# Altium schematic sheet Audio-Out.SchDoc
size A3; Date: 27.05.2014; DrawnBy: luths8; Organization: BFH; Address1: Bern University of Applied Sciences; Address2: Engineering and Information Technology; Address3: Jlcoweg 1; Address4: CH-3400 Burgdorf; DocumentNumber: 10; Revision: 1.0; SheetNumber: 3; SheetTotal: 19; CurrentDate: 27.05.2014
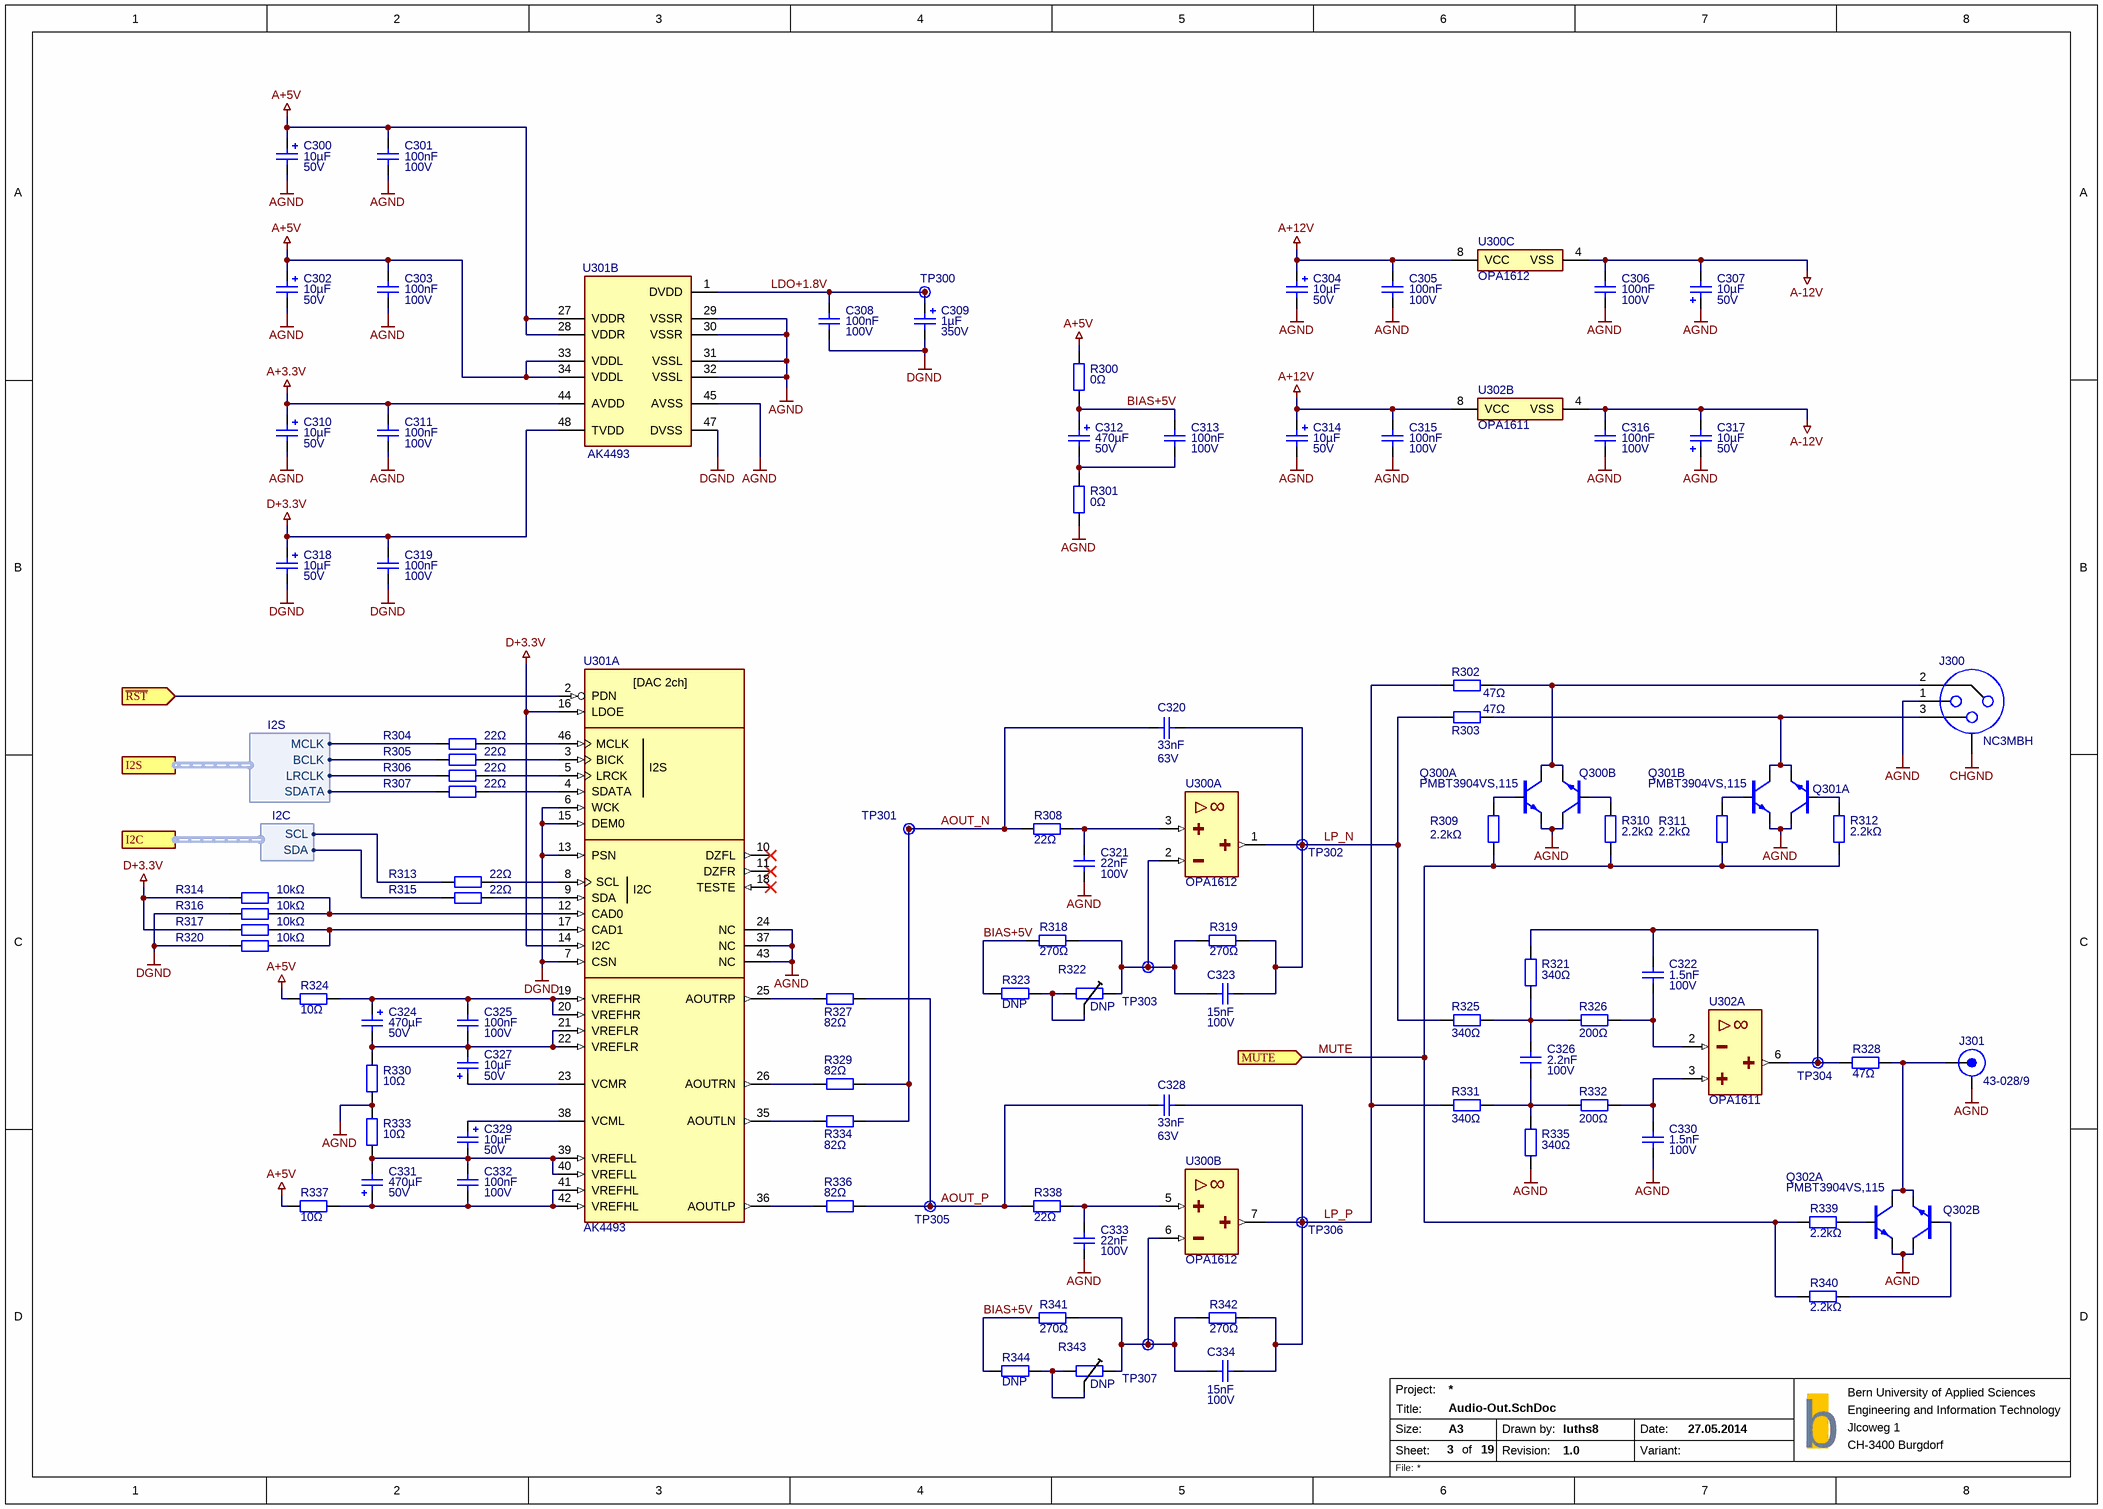
[diagram p0: Audio-Out.SchDoc]

## Parts
C300  10µF  Voltage: 50V  [CAP-5-11.5-2]
C301  100nF  Voltage: 100V  [CAP_WIMA_MKP4F]
C302  10µF  Voltage: 50V  [CAP-5-11.5-2]
C303  100nF  Voltage: 100V  [CAP_WIMA_MKP4F]
C304  10µF  Voltage: 50V  [CAP-5-11.5-2]
C305  100nF  Voltage: 100V  [CAP_WIMA_MKP4F]
C306  100nF  Voltage: 100V  [CAP_WIMA_MKP4F]
C307  10µF  Voltage: 50V  [CAP-5-11.5-2]
C308  100nF  Voltage: 100V  [CAP_WIMA_MKP4F]
C309  1µF  Voltage: 350V  [CAP-6.3-11.2-2.5]
C310  10µF  Voltage: 50V  [CAP-5-11.5-2]
C311  100nF  Voltage: 100V  [CAP_WIMA_MKP4F]
C312  470µF  Voltage: 50V  [CAP-12.5-20-5]
C313  100nF  Voltage: 100V  [CAP_WIMA_MKP4F]
C314  10µF  Voltage: 50V  [CAP-5-11.5-2]
C315  100nF  Voltage: 100V  [CAP_WIMA_MKP4F]
C316  100nF  Voltage: 100V  [CAP_WIMA_MKP4F]
C317  10µF  Voltage: 50V  [CAP-5-11.5-2]
C318  10µF  Voltage: 50V  [CAP-5-11.5-2]
C319  100nF  Voltage: 100V  [CAP_WIMA_MKP4F]
C320  33nF  Voltage: 63V  [CAP_WIMA_FKP2C]
C321  22nF  Voltage: 100V  [CAP_WIMA_FKP2C]
C322  1.5nF  Voltage: 100V  [CAP_WIMA_FKP2D]
C323  15nF  Voltage: 100V  [CAP_WIMA_FKP2C]
C324  470µF  Voltage: 50V  [CAP-12.5-20-5]
C325  100nF  Voltage: 100V  [CAP_WIMA_MKP4F]
C326  2.2nF  Voltage: 100V  [CAP_WIMA_FKP2D]
C327  10µF  Voltage: 50V  [CAP-5-11.5-2]
C328  33nF  Voltage: 63V  [CAP_WIMA_FKP2C]
C329  10µF  Voltage: 50V  [CAP-5-11.5-2]
C330  1.5nF  Voltage: 100V  [CAP_WIMA_FKP2D]
C331  470µF  Voltage: 50V  [CAP-12.5-20-5]
C332  100nF  Voltage: 100V  [CAP_WIMA_MKP4F]
C333  22nF  Voltage: 100V  [CAP_WIMA_FKP2C]
C334  15nF  Voltage: 100V  [CAP_WIMA_FKP2C]
J300  NC3MBH  [NC3MBH]
J301  43-028/9  [RCA-Plug]
Q300  PMBT3904VS,115  [SOT-666]  (parts A,B of 2)
Q301  PMBT3904VS,115  [SOT-666]  (value not drawn)  (parts A,B of 2)
Q302  PMBT3904VS,115  [SOT-666]  (parts A,B of 2)
R300  0Ω  [SMD0603RES]
R301  0Ω  [SMD0603RES]
R302  47Ω  [SMD0603RES]
R303  47Ω  [SMD0603RES]
R304  22Ω  [SMD0603RES]
R305  22Ω  [SMD0603RES]
R306  22Ω  [SMD0603RES]
R307  22Ω  [SMD0603RES]
R308  22Ω  [SMD0603RES]
R309  2.2kΩ  [SMD0603RES]
R310  2.2kΩ  [SMD0603RES]
R311  2.2kΩ  [SMD0603RES]
R312  2.2kΩ  [SMD0603RES]
R313  22Ω  [SMD0603RES]
R314  10kΩ  [SMD0603RES]
R315  22Ω  [SMD0603RES]
R316  10kΩ  [SMD0603RES]
R317  10kΩ  [SMD0603RES]
R318  270Ω  [SMD0603RES]
R319  270Ω  [SMD0603RES]
R320  10kΩ  [SMD0603RES]
R321  340Ω  [SMD0603RES]
R322  DNP  [3266]
R323  DNP  [SMD0603RES]
R324  10Ω  [SMD0603RES]
R325  340Ω  [SMD0603RES]
R326  200Ω  [SMD0603RES]
R327  82Ω  [SMD0603RES]
R328  47Ω  [SMD0603RES]
R329  82Ω  [SMD0603RES]
R330  10Ω  [SMD0603RES]
R331  340Ω  [SMD0603RES]
R332  200Ω  [SMD0603RES]
R333  10Ω  [SMD0603RES]
R334  82Ω  [SMD0603RES]
R335  340Ω  [SMD0603RES]
R336  82Ω  [SMD0603RES]
R337  10Ω  [SMD0603RES]
R338  22Ω  [SMD0603RES]
R339  2.2kΩ  [SMD0603RES]
R340  2.2kΩ  [SMD0603RES]
R341  270Ω  [SMD0603RES]
R342  270Ω  [SMD0603RES]
R343  DNP  [3266]
R344  DNP  [SMD0603RES]
TP300  Testpoint  [TP]  (value not drawn)  (no BOM)
TP301  Testpoint  [TP]  (value not drawn)  (no BOM)
TP302  Testpoint  [TP]  (value not drawn)  (no BOM)
TP303  Testpoint  [TP]  (value not drawn)  (no BOM)
TP304  Testpoint  [TP]  (value not drawn)  (no BOM)
TP305  Testpoint  [TP]  (value not drawn)  (no BOM)
TP306  Testpoint  [TP]  (value not drawn)  (no BOM)
TP307  Testpoint  [TP]  (value not drawn)  (no BOM)
U300  OPA1612  [SOIC8]  (parts A,B,C of 3)
U301  AK4493  [LQFP48]  (parts A,B of 2)
U302  OPA1611  [SOIC8]  (parts A,B of 2)

## Ports
I2C (harness I2C), I2S (harness I2S), MUTE (in), ~{RST} (in)

## Harnesses
I2S: MCLK, BCLK, LRCLK, SDATA
I2C: SCL, SDA

## Nets
A+3.3V: C310.P C311.2(q) U301.44(AVDD)
A+5V: C300.P C301.2(q) C302.P C303.2(q) R300.1 R324.2 R337.1 U301.27(VDDR) U301.28(VDDR) U301.33(VDDL) U301.34(VDDL)
A+12V: C304.P C305.2(q) C314.P C315.2(q) U300.8(VCC) U302.8(VCC)
A-12V: C306.1 C307.M(q) C316.1 C317.M(q) U300.4(VSS) U302.4(VSS)
AGND: C300.M(q) C301.1 C302.M(q) C303.1 C304.M(q) C305.1 C306.2(q) C307.P C310.M(q) C311.1 C314.M(q) C315.1 C316.2(q) C317.P C321.1 C330.1 C333.1 J300.1 J301.2 Q300.1 Q300.3 Q301.4 Q301.6 Q302.1 Q302.3 R301.2 R330.2 R333.1 R335.1 U301.24(NC) U301.29(VSSR) U301.30(VSSR) U301.31(VSSL) U301.32(VSSL) U301.37(NC) U301.43(NC) U301.45(AVSS)
CHGND: J300.0
D+3.3V: C318.P C319.2(q) R314.2 R317.2 U301.14(I2C) U301.16(LDOE) U301.48(TVDD)
DGND: C308.1 C309.M(q) C318.M(q) C319.1 R316.2 R320.2 U301.6(WCK) U301.7(CSN) U301.13(PSN) U301.15(DEM0) U301.47(DVSS)
AOUT_N: C320.1 R308.2 R329.1 R334.1 TP301.1
AOUT_P: C328.1 R327.1 R336.1 R338.2 TP305.1
BIAS+5V: C312.P C313.2(q) R300.2 R318.2 R323.2 R341.2 R344.2
LDO+1.8V: C308.2(q) C309.P TP300.1 U301.1(DVDD)
LP_N: C320.2(q) C323.1 R303.2 R319.1 R325.2 TP302.1 U300.1(OUTA)
LP_P: C328.2(q) C334.1 R302.2 R331.2 R342.1 TP306.1 U300.7(OUTB)
MUTE: R309.1 R310.1 R311.1 R312.1 R339.2 R340.2 ; port MUTE
~{RST}: U301.2(PDN) ; port ~{RST}
NetC312_M: C312.M(q) C313.1 R301.1
NetC321_2: C321.2(q) R308.1 U300.3(PINA)
NetC322_1: C322.1 R321.1 R328.2 TP304.1 U302.6(OUT)
NetC322_2: C322.2(q) R326.2 U302.2(NIN)
NetC323_2: C323.2(q) R318.1 R319.2 R322.1 TP303.1 U300.2(NINA)
NetC324_M: C324.M(q) C325.1 C327.M(q) R330.1 U301.21(VREFLR) U301.22(VREFLR)
NetC324_P: C324.P C325.2(q) R324.1 U301.19(VREFHR) U301.20(VREFHR)
NetC326_1: C326.1 R321.2 R325.1 R326.1
NetC326_2: C326.2(q) R331.1 R332.1 R335.2
NetC327_P: C327.P U301.23(VCMR)
NetC329_M: C329.M(q) C331.M(q) C332.2(q) R333.2 U301.39(VREFLL) U301.40(VREFLL)
NetC329_P: C329.P U301.38(VCML)
NetC330_2: C330.2(q) R332.2 U302.3(PIN)
NetC331_P: C331.P C332.1 R337.2 U301.41(VREFHL) U301.42(VREFHL)
NetC333_2: C333.2(q) R338.1 U300.5(PINB)
NetC334_2: C334.2(q) R341.1 R342.2 R343.1 TP307.1 U300.6(NINB)
NetJ300_2: J300.2 Q300.4 Q300.6 R302.1
NetJ300_3: J300.3 Q301.1 Q301.3 R303.1
NetJ301_1: J301.1 Q302.4 Q302.6 R328.1
NetQ300_2: Q300.2 R309.2
NetQ300_5: Q300.5 R310.2
NetQ301_2: Q301.2 R312.2
NetQ301_5: Q301.5 R311.2
NetQ302_2: Q302.2 R339.1
NetQ302_5: Q302.5 R340.1
NetR304_1: R304.1 U301.46(MCLK)
NetR304_2: R304.2 ; port I2S.MCLK
NetR305_1: R305.1 U301.3(BICK)
NetR305_2: R305.2 ; port I2S.BCLK
NetR306_1: R306.1 U301.5(LRCK)
NetR306_2: R306.2 ; port I2S.LRCLK
NetR307_1: R307.1 U301.4(SDATA)
NetR307_2: R307.2 ; port I2S.SDATA
NetR313_1: R313.1 U301.8(SCL)
NetR313_2: R313.2 ; port I2C.SCL
NetR314_1: R314.1 R316.1 U301.12(CAD0)
NetR315_1: R315.1 U301.9(SDA)
NetR315_2: R315.2 ; port I2C.SDA
NetR317_1: R317.1 R320.1 U301.17(CAD1)
NetR322_2: R322.2 R322.3 R323.1
NetR327_2: R327.2 U301.25(AOUTRP)
NetR329_2: R329.2 U301.26(AOUTRN)
NetR334_2: R334.2 U301.35(AOUTLN)
NetR336_2: R336.2 U301.36(AOUTLP)
NetR343_2: R343.2 R343.3 R344.1

Not connected (* = marked no-connect by the designer): U301 10(DZFL)* 11(DZFR)* 18(TESTE)*

## Notes on the sheet
- Project:
- Size:
- Sheet:
- Title:
- A3
- of
- Drawn by:
- Revision:
- Date:
- Variant:
- b
- File:
- (in symbol AK4493, part A) [DAC 2ch]; I2S
- (in symbol OPA1611, part A) ∞
- (in symbol OPA1612, part A) ∞
- (in symbol OPA1612, part B) ∞

## Library data of the parts
C300 C302 C304 C307 C310 C314 C317 C318 C327 C329 = Capacitor Electrolytic: Elektrolytic Capacitor; Manufacturer Part No.: EEU-FR1H100
C301 C303 C305 C306 C308 C311 C313 C315 C316 C319 C325 C332 = Capacitor Ceramic: Ceramic Capacitor; Manufacturer Part No.: MKP2D031001F00KF00
C309 = Capacitor Electrolytic: Elektrolytic Capacitor; Supplier 1: Mouser; Supplier Part Number 1: 667-ECA-2VM010; Manufacturer Part No.: *
C312 C324 C331 = Capacitor Electrolytic: Elektrolytic Capacitor; Manufacturer Part No.: EEU-FR1H471
C320 C328 = Capacitor Ceramic: Ceramic Capacitor; Manufacturer Part No.: FKP2C023301L00HSSD
C321 C333 = Capacitor Ceramic: Ceramic Capacitor; Manufacturer Part No.: FKP2D022201L00HF00
C322 C330 = Capacitor Ceramic: Ceramic Capacitor; Manufacturer Part No.: FKP2D011501D00HSSD
C323 C334 = Capacitor Ceramic: Ceramic Capacitor; Manufacturer Part No.: FKP2D021501J00HSSD
C326 = Capacitor Ceramic: Ceramic Capacitor; Manufacturer Part No.: FKP2D012201D00HSSD
J300 = Connector XLR: XLR Connector Male, Panel Mount; Manufacturer Part No.: NC3MBH; System: Connector
J301 = Connector RCA: RCA Connector; Manufacturer Part No.: *; System: Connector
Q300-Q302 = Transistor Bipolar Dual: Manufacturer Part No.: PMBT3904VS,115
R300 R301 R304-R307 R309-R317 R320 R324 R330 R333 R337 R339 R340 = Resistor: Manufacturer Part No.: *
R302 R303 R328 = Resistor: Resistor Thin Film; Manufacturer Part No.: TNPW060347R0BEEA
R308 R327 R329 R334 R336 R338 = Resistor: Resistor Thin Film; Manufacturer Part No.: TNPW060322R0BEEA
R318 R319 R341 R342 = Resistor: Resistor Thin Film; Manufacturer Part No.: TNPW0603270RBEEA
R321 R325 R331 R335 = Resistor: Resistor Thin Film; Manufacturer Part No.: TNPW0603340RBEEA
R322 R343 = Resistor Trimmer: Trimmer (resistive)
R323 R344 = Resistor: Resistor Thin Film; Manufacturer Part No.: *
R326 R332 = Resistor: Resistor Thin Film; Manufacturer Part No.: TNPW0603200RBEEA
U300 = OPA1612: SoundPlus Operational Amplifier; Manufacturer Part No.: OPA1612AIDR
U301 = AK4493: 32-Bit 2ch Audio DAC; Manufacturer Part No.: AK4493EQ
U302 = OPA1611: SoundPlus Operational Amplifier; Manufacturer Part No.: OPA1611AIDR
TP300-TP307 = Testpoint: Manufacturer Part No.: *